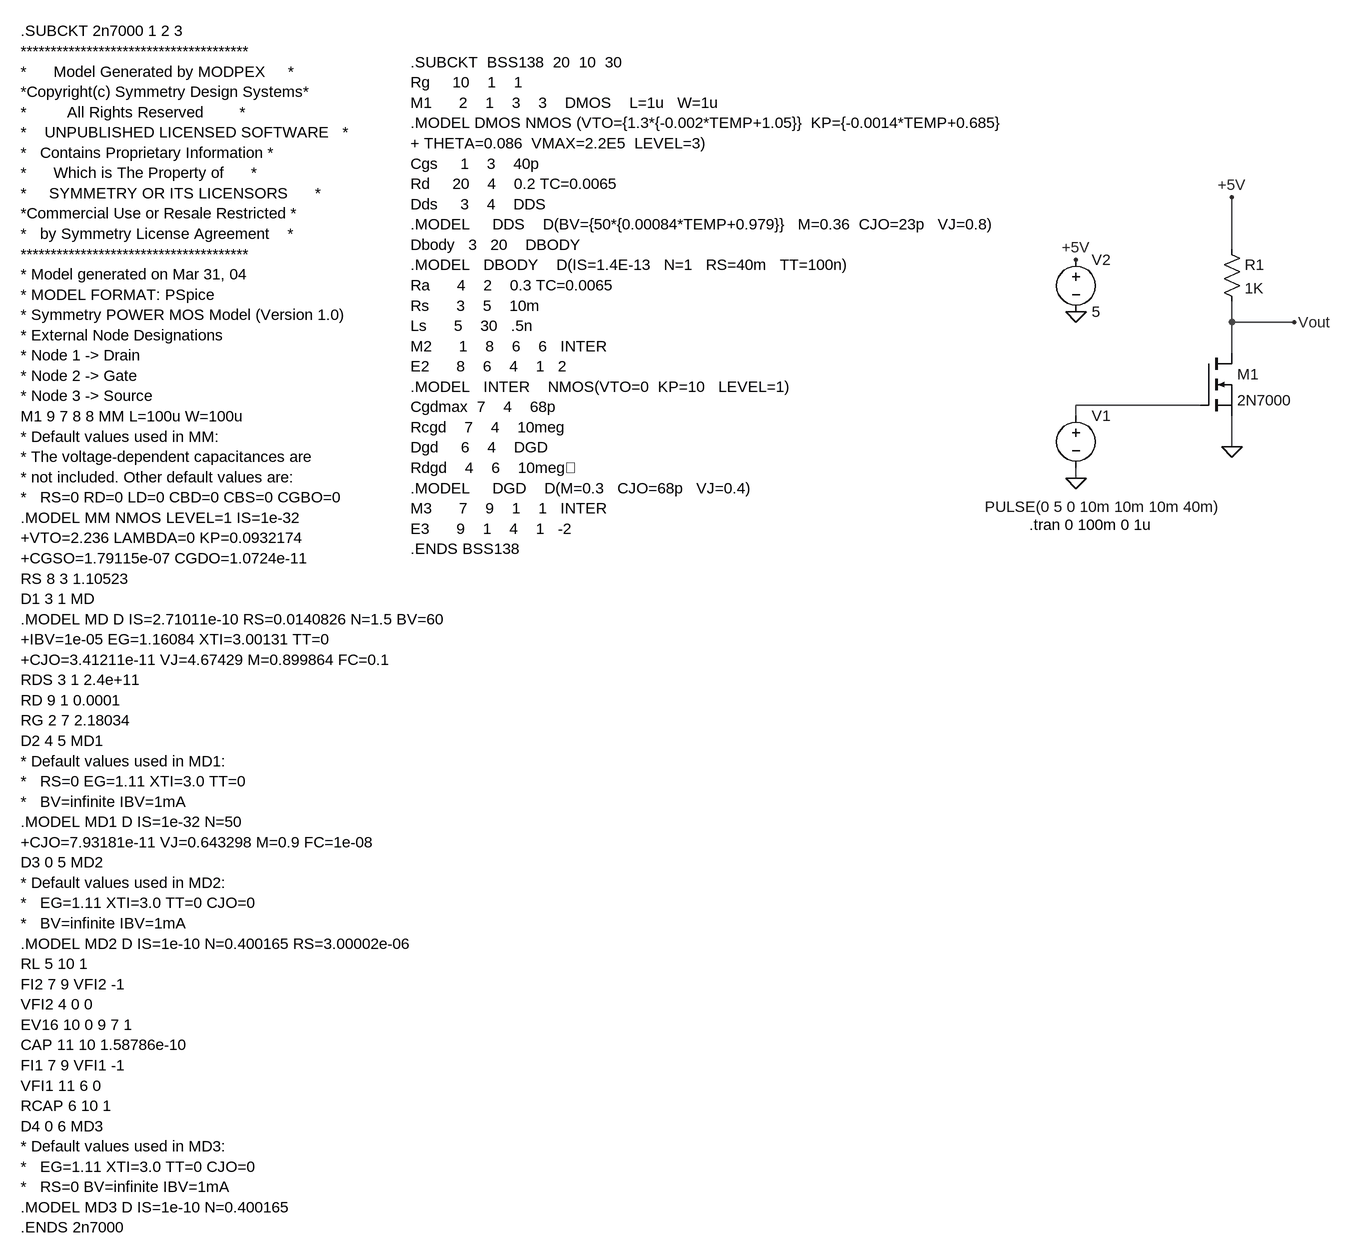
[diagram p0: schematic MOS.asc]
MOS.asc, the LTspice schematic file:
Version 4
SHEET 1 880 1252
WIRE 128 -80 128 -160
WIRE 128 32 128 0
WIRE 224 32 128 32
WIRE 128 80 128 32
WIRE 80 160 -112 160
WIRE -112 176 -112 160
WIRE 128 224 128 176
WIRE -112 272 -112 256
FLAG -112 272 0
FLAG -112 16 0
FLAG -112 -64 +5V
FLAG 128 224 0
FLAG 128 -160 +5V
FLAG 224 32 Vout
SYMBOL voltage -112 160 R0
WINDOW 123 0 0 Left 0
WINDOW 39 0 0 Left 0
WINDOW 3 -140 156 Left 2
SYMATTR Value PULSE(0 5 0 10m 10m 10m 40m)
SYMATTR InstName V1
SYMBOL voltage -112 -80 R0
WINDOW 123 0 0 Left 0
WINDOW 39 0 0 Left 0
SYMATTR InstName V2
SYMATTR Value 5
SYMBOL nmos 80 80 R0
SYMATTR InstName M1
SYMATTR Value 2N7000
SYMATTR Prefix x
SYMBOL res 112 -96 R0
SYMATTR InstName R1
SYMATTR Value 1K
TEXT -184 344 Left 2 !.tran 0 100m 0 1u
TEXT -1136 -368 Left 2 !.SUBCKT  BSS138  20  10  30\nRg     10    1    1\nM1      2    1    3    3    DMOS    L=1u   W=1u\n.MODEL DMOS NMOS (VTO={1.3*{-0.002*TEMP+1.05}}  KP={-0.0014*TEMP+0.685}\n+ THETA=0.086  VMAX=2.2E5  LEVEL=3)\nCgs     1    3    40p\nRd     20    4    0.2 TC=0.0065\nDds     3    4    DDS\n.MODEL     DDS    D(BV={50*{0.00084*TEMP+0.979}}   M=0.36  CJO=23p   VJ=0.8)\nDbody   3   20    DBODY\n.MODEL   DBODY    D(IS=1.4E-13   N=1   RS=40m   TT=100n)\nRa      4    2    0.3 TC=0.0065\nRs      3    5    10m\nLs      5    30   .5n\nM2      1    8    6    6   INTER\nE2      8    6    4    1   2\n.MODEL   INTER    NMOS(VTO=0  KP=10   LEVEL=1)\nCgdmax  7    4    68p\nRcgd    7    4    10meg\nDgd     6    4    DGD\nRdgd    4    6    10meg\n.MODEL     DGD    D(M=0.3   CJO=68p   VJ=0.4)\nM3      7    9    1    1   INTER\nE3      9    1    4    1   -2\n.ENDS BSS138
TEXT -1736 -416 Left 2 !.SUBCKT 2n7000 1 2 3\n**************************************\n*      Model Generated by MODPEX     *\n*Copyright(c) Symmetry Design Systems*\n*         All Rights Reserved        *\n*    UNPUBLISHED LICENSED SOFTWARE   *\n*   Contains Proprietary Information *\n*      Which is The Property of      *\n*     SYMMETRY OR ITS LICENSORS      *\n*Commercial Use or Resale Restricted *\n*   by Symmetry License Agreement    *\n**************************************\n* Model generated on Mar 31, 04\n* MODEL FORMAT: PSpice\n* Symmetry POWER MOS Model (Version 1.0)\n* External Node Designations\n* Node 1 -> Drain\n* Node 2 -> Gate\n* Node 3 -> Source\nM1 9 7 8 8 MM L=100u W=100u\n* Default values used in MM:\n* The voltage-dependent capacitances are\n* not included. Other default values are:\n*   RS=0 RD=0 LD=0 CBD=0 CBS=0 CGBO=0\n.MODEL MM NMOS LEVEL=1 IS=1e-32\n+VTO=2.236 LAMBDA=0 KP=0.0932174\n+CGSO=1.79115e-07 CGDO=1.0724e-11\nRS 8 3 1.10523\nD1 3 1 MD\n.MODEL MD D IS=2.71011e-10 RS=0.0140826 N=1.5 BV=60\n+IBV=1e-05 EG=1.16084 XTI=3.00131 TT=0\n+CJO=3.41211e-11 VJ=4.67429 M=0.899864 FC=0.1\nRDS 3 1 2.4e+11\nRD 9 1 0.0001\nRG 2 7 2.18034\nD2 4 5 MD1\n* Default values used in MD1:\n*   RS=0 EG=1.11 XTI=3.0 TT=0\n*   BV=infinite IBV=1mA\n.MODEL MD1 D IS=1e-32 N=50\n+CJO=7.93181e-11 VJ=0.643298 M=0.9 FC=1e-08\nD3 0 5 MD2\n* Default values used in MD2:\n*   EG=1.11 XTI=3.0 TT=0 CJO=0\n*   BV=infinite IBV=1mA\n.MODEL MD2 D IS=1e-10 N=0.400165 RS=3.00002e-06\nRL 5 10 1\nFI2 7 9 VFI2 -1\nVFI2 4 0 0\nEV16 10 0 9 7 1\nCAP 11 10 1.58786e-10\nFI1 7 9 VFI1 -1\nVFI1 11 6 0\nRCAP 6 10 1\nD4 0 6 MD3\n* Default values used in MD3:\n*   EG=1.11 XTI=3.0 TT=0 CJO=0\n*   RS=0 BV=infinite IBV=1mA\n.MODEL MD3 D IS=1e-10 N=0.400165\n.ENDS 2n7000

The netlist it stands for:
* MOS.asc
V1 N001 0 PULSE(0 5 0 10m 10m 10m 40m)
V2 +5V 0 5
XM1 Vout N001 0 2N7000  ; pins D G S
R1 +5V Vout 1K
.tran 0 100m 0 1u
.SUBCKT  BSS138  20  10  30
Rg     10    1    1
M1      2    1    3    3    DMOS    L=1u   W=1u
.MODEL DMOS NMOS (VTO={1.3*{-0.002*TEMP+1.05}}  KP={-0.0014*TEMP+0.685}
+ THETA=0.086  VMAX=2.2E5  LEVEL=3)
Cgs     1    3    40p
Rd     20    4    0.2 TC=0.0065
Dds     3    4    DDS
.MODEL     DDS    D(BV={50*{0.00084*TEMP+0.979}}   M=0.36  CJO=23p   VJ=0.8)
Dbody   3   20    DBODY
.MODEL   DBODY    D(IS=1.4E-13   N=1   RS=40m   TT=100n)
Ra      4    2    0.3 TC=0.0065
Rs      3    5    10m
Ls      5    30   .5n
M2      1    8    6    6   INTER
E2      8    6    4    1   2
.MODEL   INTER    NMOS(VTO=0  KP=10   LEVEL=1)
Cgdmax  7    4    68p
Rcgd    7    4    10meg
Dgd     6    4    DGD
Rdgd    4    6    10meg
.MODEL     DGD    D(M=0.3   CJO=68p   VJ=0.4)
M3      7    9    1    1   INTER
E3      9    1    4    1   -2
.ENDS BSS138
.SUBCKT 2n7000 1 2 3
**************************************
*      Model Generated by MODPEX     *
*Copyright(c) Symmetry Design Systems*
*         All Rights Reserved        *
*    UNPUBLISHED LICENSED SOFTWARE   *
*   Contains Proprietary Information *
*      Which is The Property of      *
*     SYMMETRY OR ITS LICENSORS      *
*Commercial Use or Resale Restricted *
*   by Symmetry License Agreement    *
**************************************
* Model generated on Mar 31, 04
* MODEL FORMAT: PSpice
* Symmetry POWER MOS Model (Version 1.0)
* External Node Designations
* Node 1 -> Drain
* Node 2 -> Gate
* Node 3 -> Source
M1 9 7 8 8 MM L=100u W=100u
* Default values used in MM:
* The voltage-dependent capacitances are
* not included. Other default values are:
*   RS=0 RD=0 LD=0 CBD=0 CBS=0 CGBO=0
.MODEL MM NMOS LEVEL=1 IS=1e-32
+VTO=2.236 LAMBDA=0 KP=0.0932174
+CGSO=1.79115e-07 CGDO=1.0724e-11
RS 8 3 1.10523
D1 3 1 MD
.MODEL MD D IS=2.71011e-10 RS=0.0140826 N=1.5 BV=60
+IBV=1e-05 EG=1.16084 XTI=3.00131 TT=0
+CJO=3.41211e-11 VJ=4.67429 M=0.899864 FC=0.1
RDS 3 1 2.4e+11
RD 9 1 0.0001
RG 2 7 2.18034
D2 4 5 MD1
* Default values used in MD1:
*   RS=0 EG=1.11 XTI=3.0 TT=0
*   BV=infinite IBV=1mA
.MODEL MD1 D IS=1e-32 N=50
+CJO=7.93181e-11 VJ=0.643298 M=0.9 FC=1e-08
D3 0 5 MD2
* Default values used in MD2:
*   EG=1.11 XTI=3.0 TT=0 CJO=0
*   BV=infinite IBV=1mA
.MODEL MD2 D IS=1e-10 N=0.400165 RS=3.00002e-06
RL 5 10 1
FI2 7 9 VFI2 -1
VFI2 4 0 0
EV16 10 0 9 7 1
CAP 11 10 1.58786e-10
FI1 7 9 VFI1 -1
VFI1 11 6 0
RCAP 6 10 1
D4 0 6 MD3
* Default values used in MD3:
*   EG=1.11 XTI=3.0 TT=0 CJO=0
*   RS=0 BV=infinite IBV=1mA
.MODEL MD3 D IS=1e-10 N=0.400165
.ENDS 2n7000
.backanno
.end